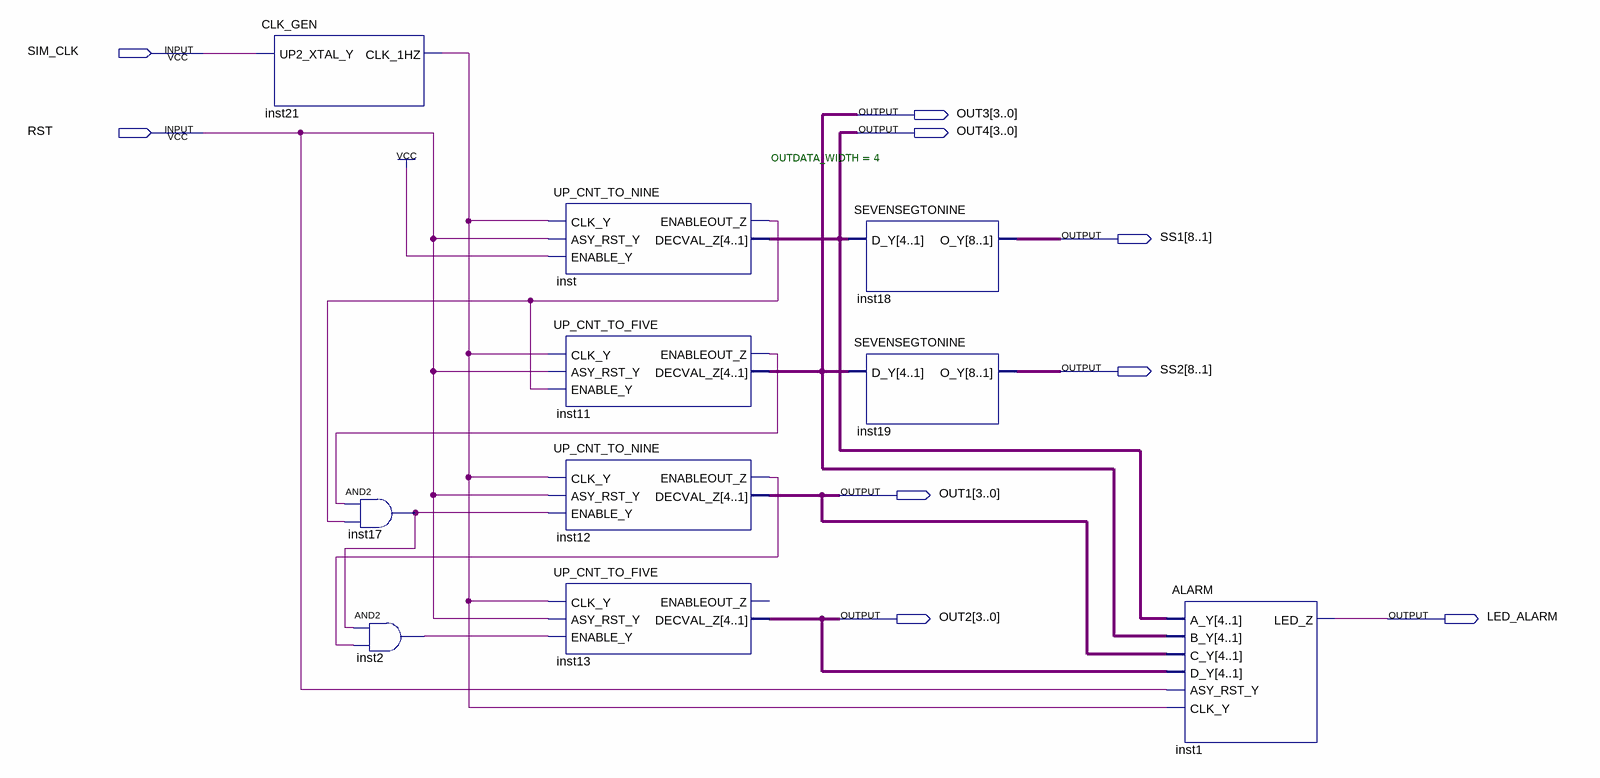
[diagram p0: schematic sheet]
// Quartus schematic Project4_FLEX.bdf as structural Verilog: 10 symbols, 9 pins
module Project4_FLEX (
  input  SIM_CLK,
  input  RST,
  output [3:0] OUT3,
  output [3:0] OUT4,
  output [8:1] SS1,
  output [8:1] SS2,
  output [3:0] OUT1,
  output [3:0] OUT2,
  output LED_ALARM
);

  wire inst2_out, inst11_enableout_z, inst12_enableout_z, inst17_out, inst21_clk_1hz, inst_enableout_z;

  CLK_GEN inst21 (.UP2_XTAL_Y(SIM_CLK), .CLK_1HZ(inst21_clk_1hz));
  and inst17 (inst17_out, inst11_enableout_z, inst_enableout_z);
  and inst2 (inst2_out, inst17_out, inst12_enableout_z);
  UP_CNT_TO_NINE #(.OUTDATA_WIDTH(4)) inst (
    .CLK_Y(inst21_clk_1hz), .ASY_RST_Y(RST), .ENABLE_Y(1'b1), .ENABLEOUT_Z(inst_enableout_z), .DECVAL_Z(OUT4));
  UP_CNT_TO_FIVE inst11 (
    .CLK_Y(inst21_clk_1hz), .ASY_RST_Y(RST), .ENABLE_Y(inst_enableout_z), .ENABLEOUT_Z(inst11_enableout_z),
    .DECVAL_Z(OUT3));
  UP_CNT_TO_NINE inst12 (
    .CLK_Y(inst21_clk_1hz), .ASY_RST_Y(RST), .ENABLE_Y(inst17_out), .ENABLEOUT_Z(inst12_enableout_z),
    .DECVAL_Z(OUT1));
  UP_CNT_TO_FIVE inst13 (
    .CLK_Y(inst21_clk_1hz), .ASY_RST_Y(RST), .ENABLE_Y(inst2_out), .DECVAL_Z(OUT2));  // open: ENABLEOUT_Z
  SEVENSEGTONINE inst18 (.D_Y(OUT4), .O_Y(SS1));
  SEVENSEGTONINE inst19 (.D_Y(OUT3), .O_Y(SS2));
  ALARM inst1 (
    .A_Y(OUT4), .B_Y(OUT3), .C_Y(OUT1), .D_Y(OUT2), .ASY_RST_Y(RST), .CLK_Y(inst21_clk_1hz), .LED_Z(LED_ALARM));
endmodule
